# EAGLE design PortExpanderCircuit (EAGLE 6.2)
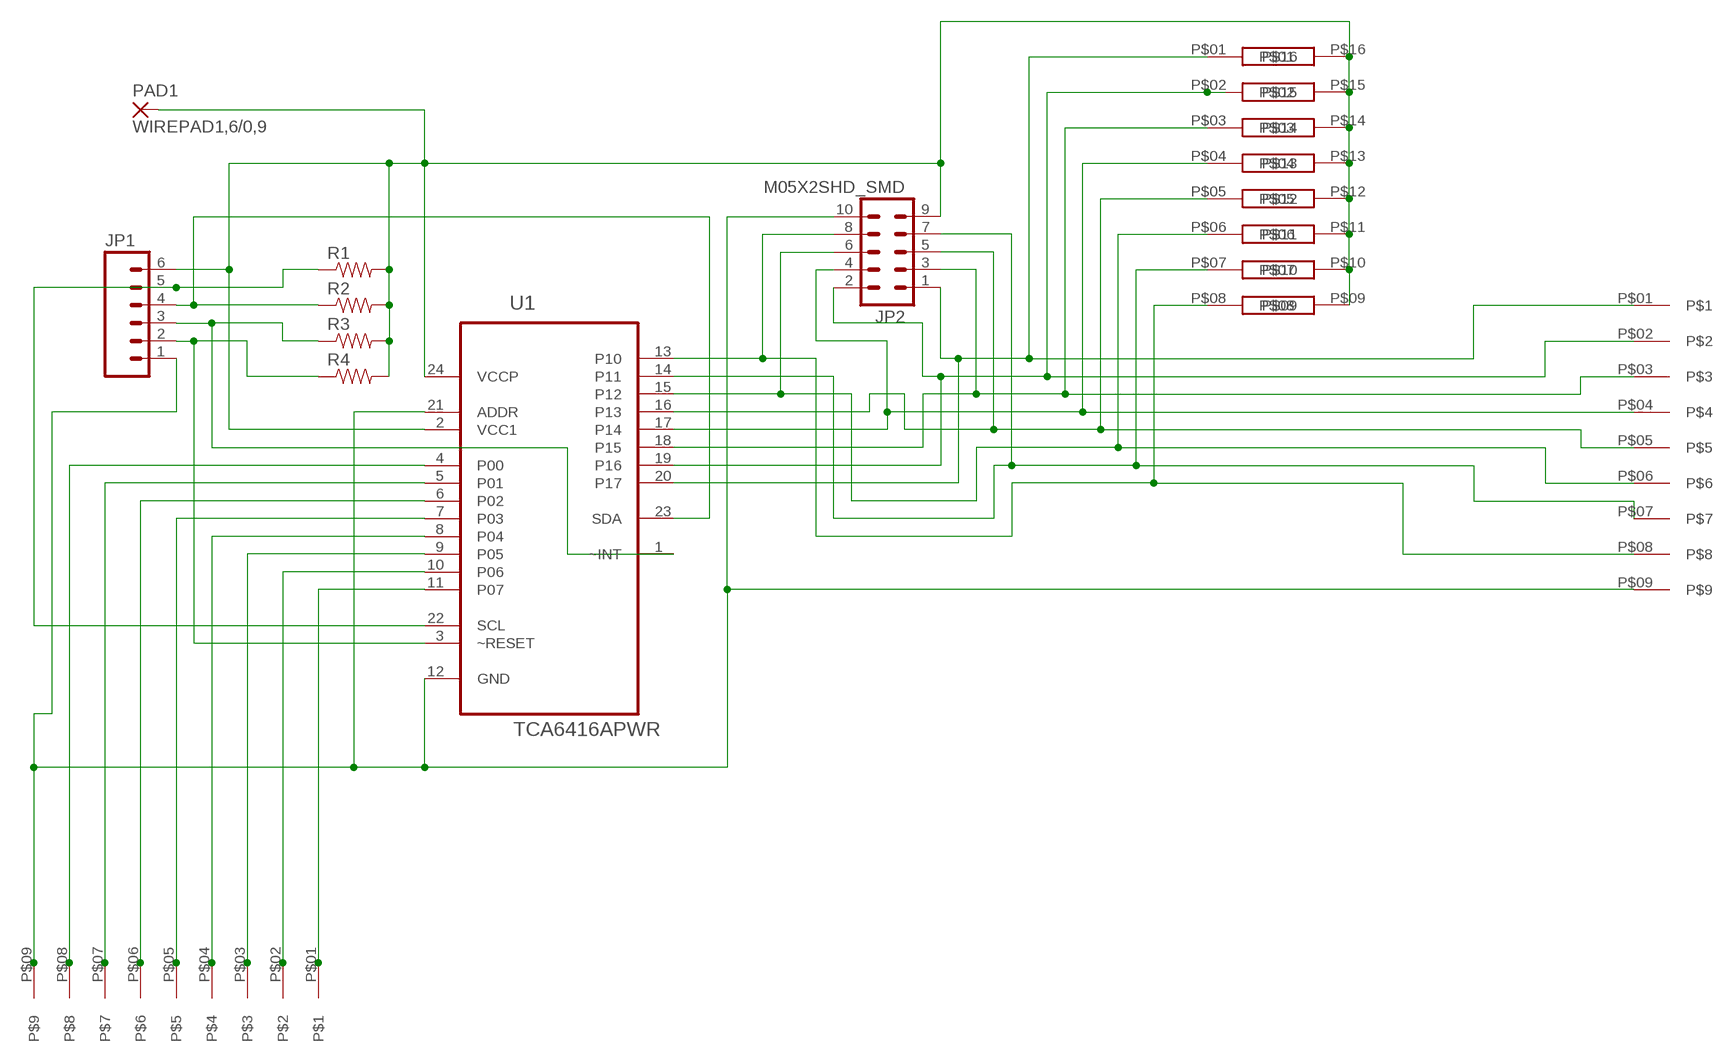
[diagram p0: schematic, sheet 1]

## Parts
JP1  M06LOCK_LONGPADS  [1X06_LOCK_LONGPADS]
JP2  M05X2SHD_SMD  [2X5-SHROUDED_SMD]
PAD1  WIREPAD1,6/0,9  [1,6/0,9]
R1  RESISTOR0805-RES  [0805]
R2  RESISTOR0805-RES  [0805]
R3  RESISTOR0805-RES  [0805]
R4  RESISTOR0805-RES  [0805]
U1  TCA6416APWR  [SOP65P640X120-24N]
U$1  TECONN_FPC_FFC_84953-9  [TECONN_84953-9]
U$2  TECONN_FPC_FFC_84953-9  [TECONN_84953-9]
U$3  EXB-A10P_8_RESISTOR_ARRAY  [EXB-A10P]

## Nets
N$2: JP1.1 JP2.10 U1.12(GND) U1.21(ADDR) U$1.P$09 U$2.P$09
N$3: JP2.8 U1.13(P10) U$1.P$08 U$3.P$08
N$4: JP2.7 U1.14(P11) U$1.P$07 U$3.P$07
N$5: JP2.6 U1.15(P12) U$1.P$06 U$3.P$06
N$6: JP2.5 U1.16(P13) U$1.P$05 U$3.P$05
N$7: JP2.4 U1.17(P14) U$1.P$04 U$3.P$04
N$8: JP2.3 U1.18(P15) U$1.P$03 U$3.P$03
N$9: JP2.2 U1.19(P16) U$1.P$02 U$3.P$02
N$10: JP2.1 U1.20(P17) U$1.P$01 U$3.P$01
N$12: U1.4(P00) U$2.P$08
N$13: U1.5(P01) U$2.P$07
N$14: U1.6(P02) U$2.P$06
N$15: U1.7(P03) U$2.P$05
N$16: U1.8(P04) U$2.P$04
N$17: U1.9(P05) U$2.P$03
N$18: U1.10(P06) U$2.P$02
N$19: U1.11(P07) U$2.P$01
N$21: JP1.5 R1.1 U1.22(SCL)
N$22: JP1.4 R2.1 U1.23(SDA)
N$23: JP1.3 R3.1 U1.1(~INT)
N$26: JP1.6 JP2.9 PAD1.1(P) R1.2 R2.2 R3.2 R4.2 U1.2(VCC1) U1.24(VCCP) U$3.P$09 U$3.P$10 U$3.P$11 U$3.P$12 U$3.P$13 U$3.P$14 U$3.P$15 U$3.P$16
N$29: JP1.2 R4.1 U1.3(~RESET)

## Library data of the parts
JP1 = SparkFun:M06: Header 6 Standard 6-pin 0.1" header. Use with straight break away headers (SKU : PRT-00116), right angle break away headers (PRT-00553), swiss pins (PRT-00743), machine pins (PRT-00117), and female headers (PRT-00115). Molex polarized connector foot print use with SKU : PRT-08094 with associated crimp pins and housings. NOTES ON THE VARIANTS LOCK and LOCK_LONGPADS... This footprint was designed to help hold the alignment of a through-hole component (i.e. 6-pin header) while soldering it into place. You may notice that each hole has been shifted either up or down by 0.005 of an inch from it's more standard position (which is a perfectly straight line). This slight alteration caused the pins (the squares in the middle) to touch the edges of the holes. Because they are alternating, it causes a "brace" to hold the component in place. 0.005 has proven to be the perfect amount of "off-center" position when using our standard breakaway headers. Although looks a little odd when you look at the bare footprint, once you have a header in there, the alteration is very hard to notice. Also, if you push a header all the way into place, it is covered up entirely on the bottom side. This idea of altering the position of holes to aid alignment will be further integrated into the Sparkfun Library for other footprints. It can help hold any component with 3 or more connection pins.
JP2 = SparkFun:M05X2: Header 5x2 Standard 10-pin dual row 0.1" header. Commonly used with AVR-ISP. Use with Spark Fun Electronics SKU: PRT-00778
PAD1 = wirepad:WIREPAD: Wire PAD connect wire on PCB
R1-R4 = SparkFun:RESISTOR: Resistor Basic schematic elements and footprints for 0603, 1206, and PTH resistors.
U1 = Texas Instruments_By_element14_Batch_1:TCA6416APWR: I/O EXPANDER; MPN: TCA6416APWR; OC_FARNELL: 1754897; OC_NEWARK: 10R6151; PACKAGE: TSSOP-24; SUPPLIER: Texas Instruments
U$1 U$2 = CindysStuff:TECONN_FPC_FFC_84953-9
U$3 = CindysStuff:EXB-A10P_8_RESISTOR_ARRAY

## Board
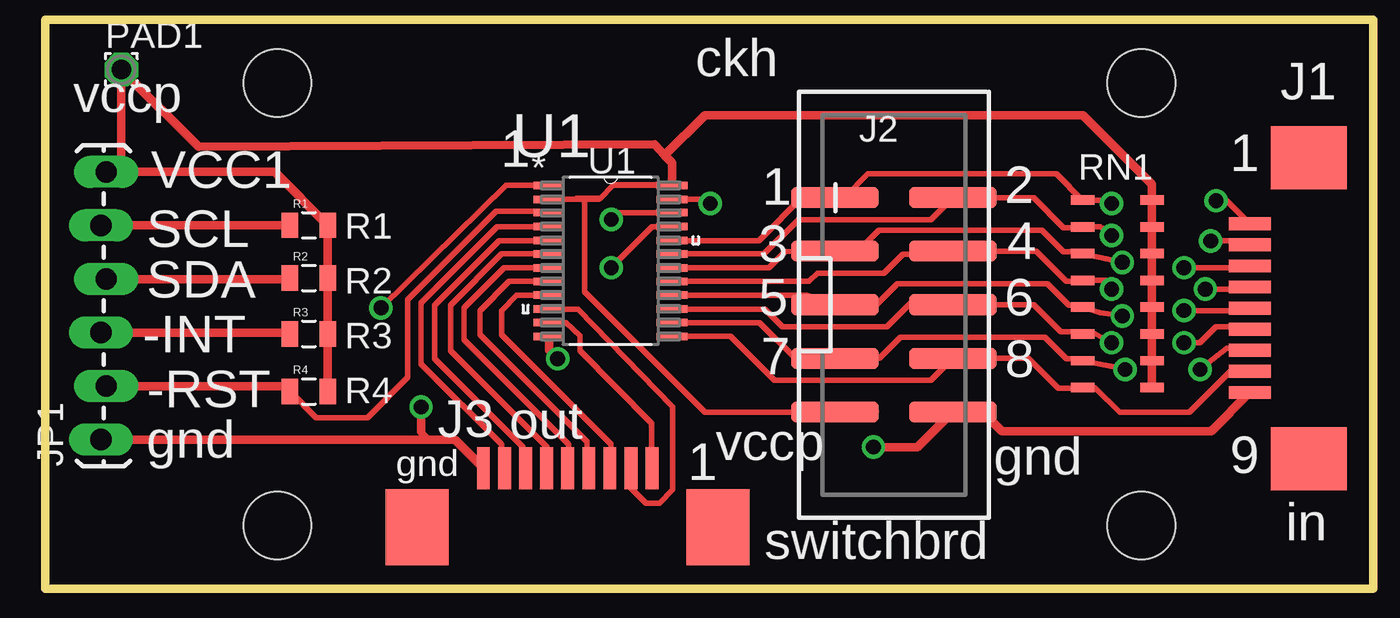
[diagram p1: board, top side]
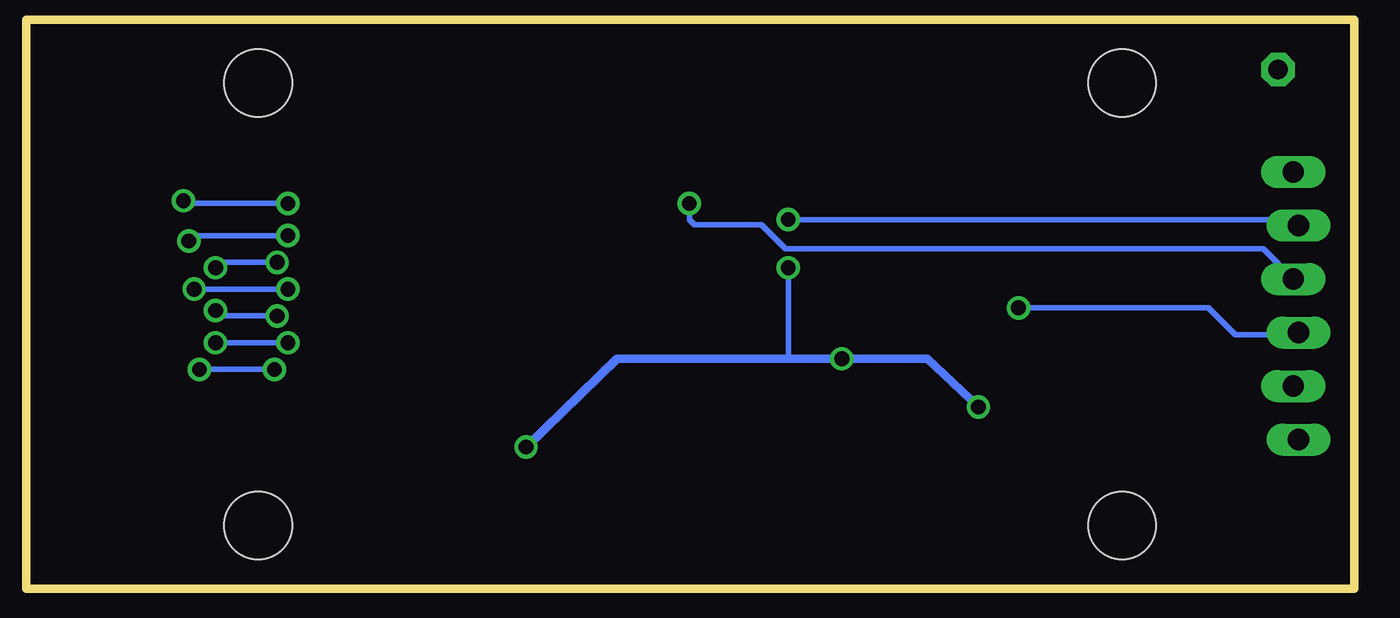
[diagram p2: board, bottom side, seen from below]

No outline drawn. Coordinates in mm, seen from the top.
Copper layers (1*16): Top 0.035mm / dielectric 1.5mm / Bottom 0.035mm
Design rules: minimum track width 10mil, minimum drill 20mil, track to track 8mil, track to pad 8mil, pad to pad 8mil, via to via 8mil, smd to smd 8mil, copper to edge 40mil, drill to drill 8mil, minimum pad ring 10mil, minimum via ring 8mil, stop-mask expansion 4mil, vias tented up to drill 0mil, thermal gap 10mil
Holes 3.2 mm at 6,8 6,-13 47,8 47,-13
Milling: 4 lines

### Footprints (pad centres in the part's own frame; a part is rotated, then mirrored left to right if it is on the bottom)
1X06_LOCK_LONGPADS = drill 1.016 long: 1 0,0; 2 2.54,-0.254; 3 5.08,0; 4 7.62,-0.254; 5 10.16,0; 6 12.7,-0.254
2X5-SHROUDED_SMD = smd 4.15 x 1: 1 -2.794,5.08; 2 2.794,5.08; 3 -2.794,2.54; 4 2.794,2.54; 5 -2.794,0; 6 2.794,0; 7 -2.794,-2.54; 8 2.794,-2.54; 9 -2.794,-5.08; 10 2.794,-5.08
1,6/0,9 = drill 0.914 pad 1.6 octagon: 1 0,0
0805 = smd 0.8 x 1.2: 1 -0.9,0; 2 0.9,0
SOP65P640X120-24N = smd 1.473 x 0.356: 1 -2.921,3.581; 2 -2.921,2.921; 3 -2.921,2.286; 4 -2.921,1.626; 5 -2.921,0.965; 6 -2.921,0.33; 7 -2.921,-0.33; 8 -2.921,-0.965; 9 -2.921,-1.626; 10 -2.921,-2.286; 11 -2.921,-2.921; 12 -2.921,-3.581; 13 2.921,-3.581; 14 2.921,-2.921; 15 2.921,-2.286; 16 2.921,-1.626; 17 2.921,-0.965; 18 2.921,-0.33; 19 2.921,0.33; 20 2.921,0.965; 21 2.921,1.626; 22 2.921,2.286; 23 2.921,2.921; 24 2.921,3.581
TECONN_84953-9 = smd 2.98 x 3.6: P$0 -7.14,-2.8; P$10 7.14,-2.8 | smd 0.61 x 2: P$01 4,0; P$02 3,0; P$03 2,0; P$04 1,0; P$05 0,0; P$06 -1,0; P$07 -2,0; P$08 -3,0; P$09 -4,0
EXB-A10P = smd 1.1 x 0.45: P$01 -1.65,4.445; P$02 -1.65,3.175; P$03 -1.65,1.905; P$04 -1.65,0.635; P$05 -1.65,-0.635; P$06 -1.65,-1.905; P$07 -1.65,-3.175; P$08 -1.65,-4.445; P$09 1.65,-4.445; P$10 1.65,-3.175; P$11 1.65,-1.905; P$12 1.65,-0.635; P$13 1.65,0.635; P$14 1.65,1.905; P$15 1.65,3.175; P$16 1.65,4.445

### Placement (x,y rotation side)
JP1  -2.37,-8.92 90 top
JP2  35.26,-2.52 0 top
PAD1  -1.4,8.64 0 top
R1  7.5,1.25 0 top
R2  7.5,-1.25 0 top
R3  7.5,-3.9 0 top
R4  7.5,-6.63 0 top
U1  21.82,-0.44 0 top
U$1  52.15,-2.68 90 top
U$2  19.78,-10.27 0 top
U$3  45.86,-2 0 top

### Tracks (layer width: path | path; a pad name or v marks a point on that pad's centre or on a via)
N$2  (via drill 0.7)
  Top 0.254: 18.9,-4.67 v19.3,-5.08 | 12.83,-8.54 13.21,-8.92 | U1.21 23.79,1.19 v21.84,-0.76
  Top 0.406: JP1.1 13.21,-8.92 14.43,-8.92 U$2.P$09 | U1.12 18.9,-4.67 | v12.83,-7.37 12.83,-8.54 | v34.29,-9.27 36.38,-9.27 JP2.10 39.48,-7.6 40.39,-8.51 50.32,-8.51 U$1.P$09
  Bottom 0.254: v21.84,-0.76 21.84,-5.08
  Bottom 0.406: v12.83,-7.37 15.24,-5.08 v19.3,-5.08 21.84,-5.08 29.97,-5.08 v34.29,-9.27
N$3
  Top 0.254: U1.13 27.52,-4.02 29.59,-6.1 37.02,-6.1 JP2.8 41.64,-5.06 43.05,-6.48 44.18,-6.48 U$3.P$08 44.8,-6.45 45.97,-7.62 49.28,-7.62 51.31,-5.59 52.06,-5.59 U$1.P$08
N$4  (via drill 0.7)
  Top 0.254: U1.14 28.89,-3.36 30.61,-5.08 32.45,-5.08 JP2.7 34.56,-5.06 35.56,-4.06 42.42,-4.06 43.43,-5.08 44.12,-5.08 U$3.P$07 45.56,-5.43 v46.23,-5.59 | v49.78,-5.59 51.05,-4.57 52.04,-4.57 U$1.P$07
  Bottom 0.254: v46.23,-5.59 v49.78,-5.59
N$5  (via drill 0.7)
  Top 0.254: U1.15 29.14,-2.73 29.97,-3.56 34.92,-3.56 36.07,-2.41 37.95,-2.41 JP2.6 41.89,-2.52 43.18,-3.81 44.12,-3.81 U$3.P$06 44.8,-3.9 v45.59,-4.32 | v49.02,-4.32 49.78,-4.32 50.55,-3.56 52.03,-3.56 U$1.P$06
  Bottom 0.254: v45.59,-4.32 v49.02,-4.32
N$6  (via drill 0.7)
  Top 0.254: U1.16 31.12,-2.07 JP2.5 34.44,-2.52 35.43,-1.52 42.55,-1.52 43.56,-2.54 44.12,-2.54 U$3.P$05 45.05,-2.89 v46.1,-3.05 | v49.02,-2.79 52.04,-2.79 U$1.P$05
  Bottom 0.254: v46.1,-3.05 48.77,-3.05 v49.02,-2.79
N$7  (via drill 0.7)
  Top 0.254: U1.17 31.23,-1.41 31.62,-1.02 34.8,-1.02 35.69,-0.13 37.91,-0.13 JP2.4 42.02,0.02 43.43,-1.4 44.18,-1.4 U$3.P$04 45.31,-1.36 v45.59,-1.78 | v50.04,-1.78 52.05,-1.78 U$1.P$04
  Bottom 0.254: v45.59,-1.78 v50.04,-1.78
N$8  (via drill 0.7)
  Top 0.254: U1.18 29.33,-0.77 30.1,0 JP2.3 33.55,0.02 34.54,1.02 42.29,1.02 43.31,0 44.12,0 U$3.P$03 45.31,-0.35 v46.1,-0.51 | v49.02,-0.76 52.07,-0.76 U$1.P$03
  Bottom 0.254: v46.1,-0.51 49.02,-0.51 v49.02,-0.76
N$9  (via drill 0.7)
  Top 0.254: U1.19 29.1,-0.11 30.73,1.52 37.02,1.52 JP2.2 41.89,2.56 43.31,1.14 44.18,1.14 U$3.P$02 45.05,1.18 v45.59,0.76 | v50.29,0.51 51.96,0.51 U$1.P$02
  Bottom 0.254: v45.59,0.76 50.04,0.76 v50.29,0.51
N$10  (via drill 0.7)
  Top 0.254: U1.20 28.85,0.53 30.99,2.67 32.36,2.67 JP2.1 32.91,2.56 34.04,3.68 42.97,3.68 U$3.P$01 45.43,2.44 v45.59,2.29 | v50.55,2.41 51.06,2.41 U$1.P$01
  Bottom 0.254: v45.59,2.29 50.42,2.29 v50.55,2.41
N$12
  Top 0.254: U1.4 16.43,1.19 12.83,-2.41 12.83,-5.33 16.64,-9.14 16.64,-10.13 U$2.P$08
N$13
  Top 0.254: U1.5 16.53,0.53 13.46,-2.54 13.46,-5.08 17.65,-9.27 17.65,-10.14 U$2.P$07
N$14
  Top 0.254: U1.6 16.65,-0.11 14.22,-2.54 14.22,-4.7 18.8,-9.27 18.8,-10.25 U$2.P$06
N$15
  Top 0.254: U1.7 16.76,-0.77 14.86,-2.67 14.86,-4.19 19.81,-9.14 19.81,-10.24 U$2.P$05
N$16
  Top 0.254: U1.8 17.01,-1.41 15.62,-2.79 15.62,-3.94 20.7,-9.02 20.7,-10.19 U$2.P$04
N$17
  Top 0.254: U1.9 17.36,-2.07 16.64,-2.79 16.64,-3.94 21.84,-9.14 21.84,-10.21 U$2.P$03
N$18
  Top 0.254: U1.10 20.26,-2.73 24.77,-7.37 24.77,-11.3 24.13,-11.94 23.5,-11.94 22.73,-11.18 22.73,-10.32 U$2.P$02
N$19
  Top 0.254: U1.11 19.7,-3.36 20.36,-4 20.36,-4.7 23.75,-8.13 23.75,-10.24 U$2.P$01
N$21  (via drill 0.7)
  Top 0.254: U1.22 22.17,1.85 v21.84,1.52
  Top 0.406: R1.1 JP1.5
  Bottom 0.254: v21.84,1.52 -2.09,1.52 JP1.5
N$22  (via drill 0.7)
  Top 0.254: U1.23 26.35,2.48 v26.54,2.29
  Top 0.406: JP1.4 6.55,-1.3 R2.1
  Bottom 0.254: v26.54,2.29 26.54,1.52 26.29,1.27 23.11,1.27 21.97,0.13 -0.69,0.13 JP1.4
N$23  (via drill 0.7)
  Top 0.254: U1.1 16.86,3.14 v10.92,-2.67
  Top 0.406: JP1.3 6.54,-3.84 R3.1
  Bottom 0.254: v10.92,-2.67 1.91,-2.67 0.64,-3.94 -2.27,-3.94 JP1.3
N$26
  Top 0.254: U1.2 21.28,2.48 21.34,2.54 | 21.94,3.14 21.97,3.17 24.71,3.17 U1.24 21.94,3.14 | 21.94,3.14 21.34,2.54 | 21.34,2.54 20.57,2.54 | 20.19,2.54 20.57,2.54 | 20.57,2.54 20.57,-1.91 26.29,-7.62 32.45,-7.62 JP2.9 34.44,-7.6
  Top 0.406: U1.24 24.74,4.21 24.38,4.57 | 24.38,4.57 23.91,5.09 2.27,4.97 PAD1.1 -1.4,3.56 -1.89,3.56 JP1.6 5.87,3.78 R1.2 R2.2 R3.2 R4.2 | U$3.P$16 U$3.P$15 U$3.P$14 U$3.P$13 U$3.P$12 U$3.P$11 U$3.P$10 U$3.P$09 47.51,3.19 44.23,6.48 26.29,6.48 24.38,4.57
N$29
  Top 0.254: R4.1 7.84,-7.87 10.29,-7.87 12.19,-5.97 12.19,-2.29 16.38,1.91 18.84,1.91 U1.3
  Top 0.406: JP1.2 6.35,-6.38 R4.1

### Text on the board
tPlace: ckh | vccp | J1 | J2 | 1 | U1 | 1 | VCC1 | RN1 | 1 | 2 | R1 | SCL | 4 | 3 | SDA | R2 | 5 | 6 | -INT | R3 | 7 | 8 | -RST | R4 | J3 | out | gnd | vccp | gnd | 1 | gnd | 9 | in | switchbrd